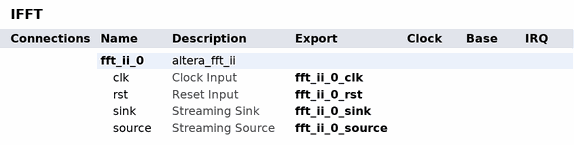
[diagram p0: system contents]
# Platform Designer (Qsys) system IFFT, Cyclone V 5CGXFC5C6F27C7
# Parameters at their usual value, and those the tool derives, are not listed.
package require -exact qsys 17.0
create_system IFFT
set_project_property DEVICE_FAMILY {Cyclone V}
set_project_property DEVICE 5CGXFC5C6F27C7

add_instance fft_ii_0 altera_fft_ii 17.0
set_instance_parameter_value fft_ii_0 data_flow {Variable Streaming}
set_instance_parameter_value fft_ii_0 data_rep {Fixed Point}
set_instance_parameter_value fft_ii_0 engine_arch {Quad Output}
set_instance_parameter_value fft_ii_0 in_width 18
set_instance_parameter_value fft_ii_0 length 1024
set_instance_parameter_value fft_ii_0 out_order Natural
set_instance_parameter_value fft_ii_0 out_width 18
set_instance_parameter_value fft_ii_0 twid_width 18

# exported interfaces
add_interface fft_ii_0_clk clock sink
set_interface_property fft_ii_0_clk EXPORT_OF fft_ii_0.clk
add_interface fft_ii_0_rst reset sink
set_interface_property fft_ii_0_rst EXPORT_OF fft_ii_0.rst
add_interface fft_ii_0_sink avalon_streaming sink
set_interface_property fft_ii_0_sink EXPORT_OF fft_ii_0.sink
add_interface fft_ii_0_source avalon_streaming source
set_interface_property fft_ii_0_source EXPORT_OF fft_ii_0.source

set_interconnect_requirement {$system} qsys_mm.clockCrossingAdapter HANDSHAKE
set_interconnect_requirement {$system} qsys_mm.enableEccProtection FALSE
set_interconnect_requirement {$system} qsys_mm.insertDefaultSlave FALSE
set_interconnect_requirement {$system} qsys_mm.maxAdditionalLatency 1

save_system IFFT.qsys
